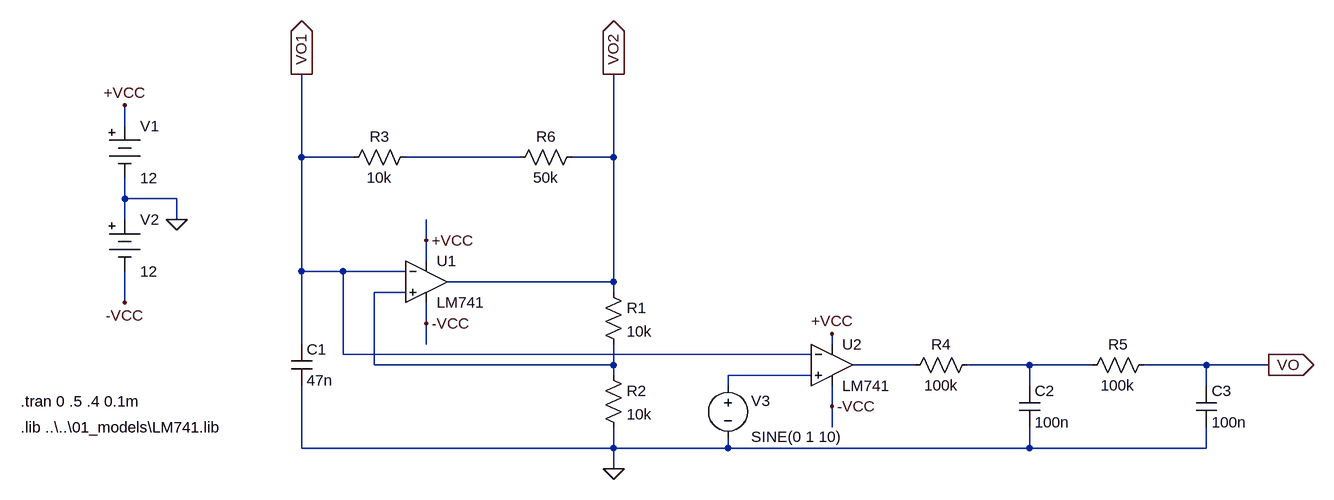
[diagram p0: schematic rcosc_03_04_02_vin_pwm_vout.asc]
rcosc_03_04_02_vin_pwm_vout.asc, the LTspice schematic file:
Version 4
SHEET 1 1764 680
WIRE -256 -160 -256 -192
WIRE 16 -112 16 -240
WIRE 96 -112 16 -112
WIRE 352 -112 176 -112
WIRE 496 -112 496 -240
WIRE 496 -112 432 -112
WIRE -256 -48 -256 -80
WIRE -176 -48 -256 -48
WIRE -256 -16 -256 -48
WIRE -176 -16 -176 -48
WIRE 208 16 208 -16
WIRE 208 48 208 16
WIRE 16 64 16 -112
WIRE 80 64 16 64
WIRE 176 64 80 64
WIRE 496 80 496 -112
WIRE 496 80 240 80
WIRE 176 96 128 96
WIRE 496 96 496 80
WIRE -256 112 -256 64
WIRE 208 144 208 112
WIRE 16 176 16 64
WIRE 208 176 208 144
WIRE 832 176 832 160
WIRE 80 192 80 64
WIRE 800 192 80 192
WIRE 128 208 128 96
WIRE 496 208 496 176
WIRE 496 208 128 208
WIRE 960 208 864 208
WIRE 1136 208 1040 208
WIRE 1232 208 1136 208
WIRE 1408 208 1312 208
WIRE 1504 208 1408 208
WIRE 496 224 496 208
WIRE 800 224 672 224
WIRE 672 240 672 224
WIRE 1136 240 1136 208
WIRE 1408 240 1408 208
WIRE 832 272 832 240
WIRE 832 304 832 272
WIRE 16 336 16 240
WIRE 496 336 496 304
WIRE 496 336 16 336
WIRE 672 336 672 320
WIRE 672 336 496 336
WIRE 1136 336 1136 304
WIRE 1136 336 672 336
WIRE 1408 336 1408 304
WIRE 1408 336 1136 336
WIRE 496 368 496 336
FLAG -176 -16 0
FLAG -256 -192 +VCC
FLAG -256 112 -VCC
FLAG 208 16 +VCC
FLAG 208 144 -VCC
FLAG 496 368 0
FLAG 16 -240 VO1
IOPIN 16 -240 Out
FLAG 496 -240 VO2
IOPIN 496 -240 Out
FLAG 832 272 -VCC
FLAG 1504 208 VO
IOPIN 1504 208 Out
FLAG 832 160 +VCC
SYMBOL Misc\\battery -256 -176 R0
WINDOW 123 0 0 Left 2
WINDOW 39 0 0 Left 2
SYMATTR InstName V1
SYMATTR Value 12
SYMBOL Misc\\battery -256 -32 R0
WINDOW 123 0 0 Left 2
WINDOW 39 0 0 Left 2
SYMATTR InstName V2
SYMATTR Value 12
SYMBOL Opamps\\opamp2 208 16 R0
SYMATTR InstName U1
SYMATTR Value LM741
SYMBOL res 480 80 R0
SYMATTR InstName R1
SYMATTR Value 10k
SYMBOL res 480 208 R0
SYMATTR InstName R2
SYMATTR Value 10k
SYMBOL res 336 -96 R270
WINDOW 0 32 56 VTop 2
WINDOW 3 0 56 VBottom 2
SYMATTR InstName R6
SYMATTR Value 50k
SYMBOL res 80 -96 R270
WINDOW 0 32 56 VTop 2
WINDOW 3 0 56 VBottom 2
SYMATTR InstName R3
SYMATTR Value 10k
SYMBOL cap 0 176 R0
SYMATTR InstName C1
SYMATTR Value 47n
SYMBOL Opamps\\opamp2 832 144 R0
SYMATTR InstName U2
SYMATTR Value LM741
SYMBOL voltage 672 224 R0
WINDOW 0 36 39 Left 2
WINDOW 3 36 95 Left 2
WINDOW 123 0 0 Left 2
WINDOW 39 0 0 Left 2
SYMATTR InstName V3
SYMATTR Value SINE(0 1 10)
SYMBOL res 1056 192 R90
WINDOW 0 0 56 VBottom 2
WINDOW 3 32 56 VTop 2
SYMATTR InstName R4
SYMATTR Value 100k
SYMBOL cap 1120 240 R0
SYMATTR InstName C2
SYMATTR Value 100n
SYMBOL cap 1392 240 R0
SYMATTR InstName C3
SYMATTR Value 100n
SYMBOL res 1328 192 R90
WINDOW 0 0 56 VBottom 2
WINDOW 3 32 56 VTop 2
SYMATTR InstName R5
SYMATTR Value 100k
TEXT -416 304 Left 2 !.lib ..\\..\\01_models\\LM741.lib
TEXT -416 264 Left 2 !.tran 0 .5 .4 0.1m

The netlist it stands for:
* rcosc_03_04_02_vin_pwm_vout.asc
V1 +VCC 0 12
V2 0 -VCC 12
XU1 N002 VO1 +VCC -VCC VO2 LM741  ; pins In+ In- V+ V- OUT
R1 VO2 N002 10k
R2 N002 0 10k
R6 N001 VO2 50k
R3 VO1 N001 10k
C1 VO1 0 47n
XU2 N005 VO1 +VCC -VCC N003 LM741  ; pins In+ In- V+ V- OUT
V3 N005 0 SINE(0 1 10)
R4 N004 N003 100k
C2 N004 0 100n
C3 VO 0 100n
R5 VO N004 100k
.lib ..\..\01_models\LM741.lib
.tran 0 .5 .4 0.1m
.backanno
.end